# EAGLE design sw4 (EAGLE 6.6.0)
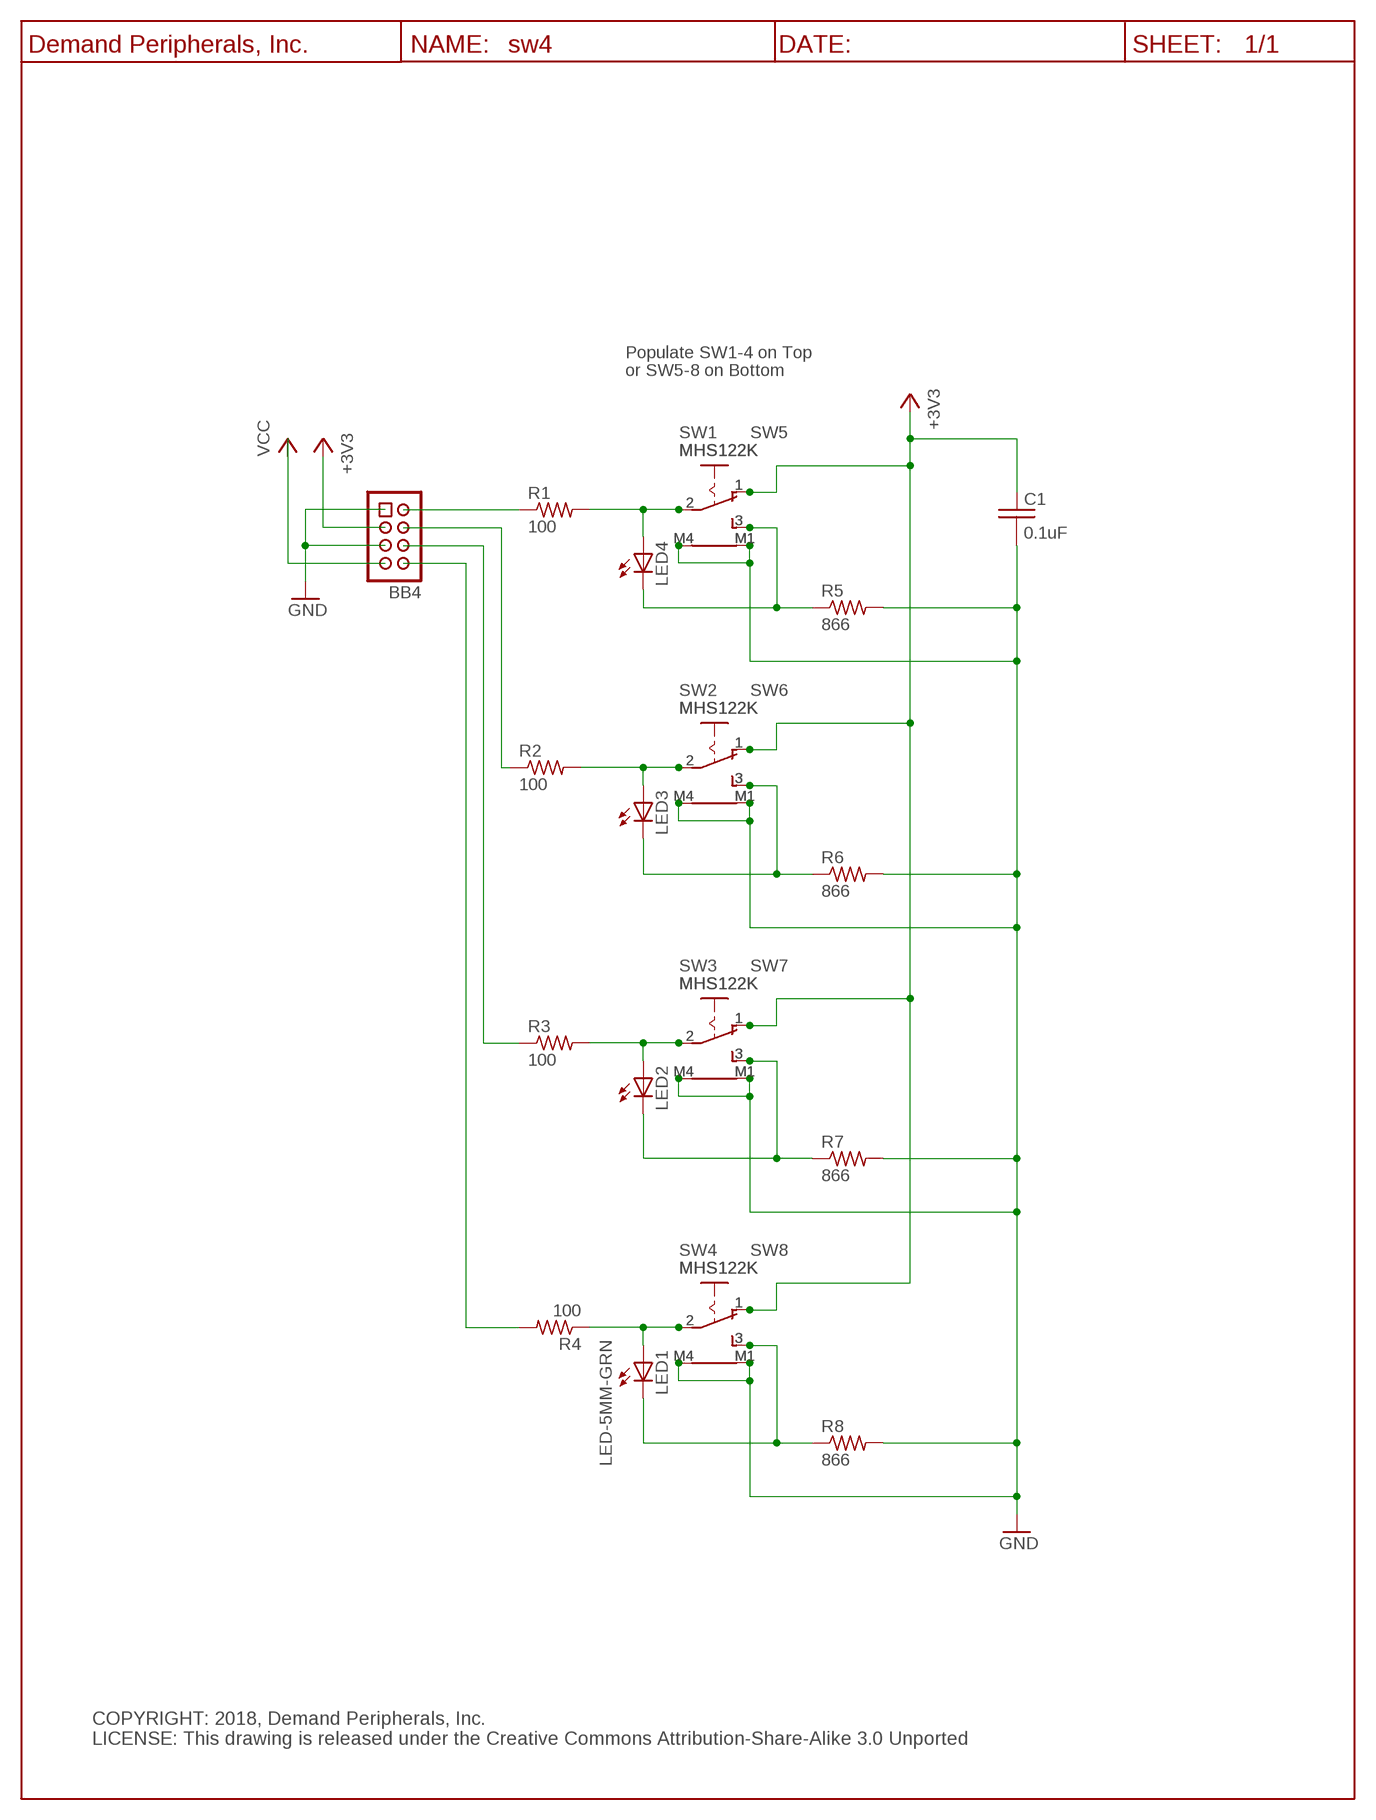
[diagram p0: schematic, sheet 1]

## Parts
BB4  hdr4x2  HDR-4X2-SHR  [HDR-4X2]
C1  0.1uF  C0.1UF_C0603  [C0603]
LED1  LED-5MM-GRN  [LED5MM]
LED2  LED-5MM-GRN  [LED5MM]
LED3  LED-5MM-GRN  [LED5MM]
LED4  LED-5MM-GRN  [LED5MM]
R1  100  R100_R0603  [R0603]
R2  100  R100_R0603  [R0603]
R3  100  R100_R0603  [R0603]
R4  100  R100_R0603  [R0603]
R5  866  R866_R0603  [R0603]
R6  866  R866_R0603  [R0603]
R7  866  R866_R0603  [R0603]
R8  866  R866_R0603  [R0603]
SW1  MHS122K  [MHS122K]
SW2  MHS122K  [MHS122K]
SW3  MHS122K  [MHS122K]
SW4  MHS122K  [MHS122K]
SW5  MHS122K  [MHS122K]
SW6  MHS122K  [MHS122K]
SW7  MHS122K  [MHS122K]
SW8  MHS122K  [MHS122K]
U$1  DP_FRAME_P  [P_FRAME]

## Nets
+3V3: BB4.3 C1.1 SW1.1(O) SW2.1(O) SW3.1(O) SW4.1(O) SW5.1(O) SW6.1(O) SW7.1(O) SW8.1(O)
GND: BB4.1 BB4.5 C1.2 R5.2 R6.2 R7.2 R8.2 SW1.M1(B1) SW1.M4(B) SW2.M1(B1) SW2.M4(B) SW3.M1(B1) SW3.M4(B) SW4.M1(B1) SW4.M4(B) SW5.M1(B1) SW5.M4(B) SW6.M1(B1) SW6.M4(B) SW7.M1(B1) SW7.M4(B) SW8.M1(B1) SW8.M4(B)
N$1: BB4.8 R4.2
N$3: LED4.C R5.1 SW1.3(S) SW5.3(S)
N$7: LED4.A R1.2 SW1.2(P) SW5.2(P)
N$9: LED3.A R2.2 SW2.2(P) SW6.2(P)
N$11: LED2.A R3.2 SW3.2(P) SW7.2(P)
N$13: LED1.A R4.1 SW4.2(P) SW8.2(P)
N$16: LED3.C R6.1 SW2.3(S) SW6.3(S)
N$17: LED2.C R7.1 SW3.3(S) SW7.3(S)
N$18: LED1.C R8.1 SW4.3(S) SW8.3(S)
N$30: BB4.2 R1.1
N$38: BB4.6 R3.1
N$41: BB4.4 R2.1
VCC: BB4.7

## Notes on the sheet
- Populate SW1-4 on Top
- or SW5-8 on Bottom
- COPYRIGHT: 2018, Demand Peripherals, Inc.
  LICENSE: This drawing is released under the Creative Commons Attribution-Share-Alike 3.0 Unported

## Library data of the parts
BB4 = dpi-conn:HDR-4X2-SHR: Shrouded 4x2 pin header; VENDOR: Digikey; VENDOR-PART-NUM: 609-3530-ND
C1 = dpi-passive:C0.1UF_: 0.1 uF Capacitor, 25V, X7R; VENDOR: Digikey; VENDOR-PART-NUM: 1276-1126-2-ND
LED1-LED4 = dpi-diopto:LED-5MM-GRN: Green LED, 5 MM, through-hole; VENDOR: Digikey; VENDOR-PART-NUM: 160-1852-ND
R1-R4 = dpi-passive:R100_: 100 Ohm resistor, 1%, 0.1 watt; VENDOR: Digikey; VENDOR-PART-NUM: 311-100HRTR-ND
R5-R8 = dpi-passive:R866_: 866 Ohm resistor, 1%, 0.1 watt; VENDOR: Digikey; VENDOR-PART-NUM: 311-866HRTR-ND
SW1-SW8 = dpi-swsens:MHS122K: SPDT SLIDE SWITCH; VENDOR: Digikey; VENDOR-PART-NUM: 679-1866-ND
U$1 = dpi-sym:DP_FRAME_P: Portrait/Letter Document Frame

## Board
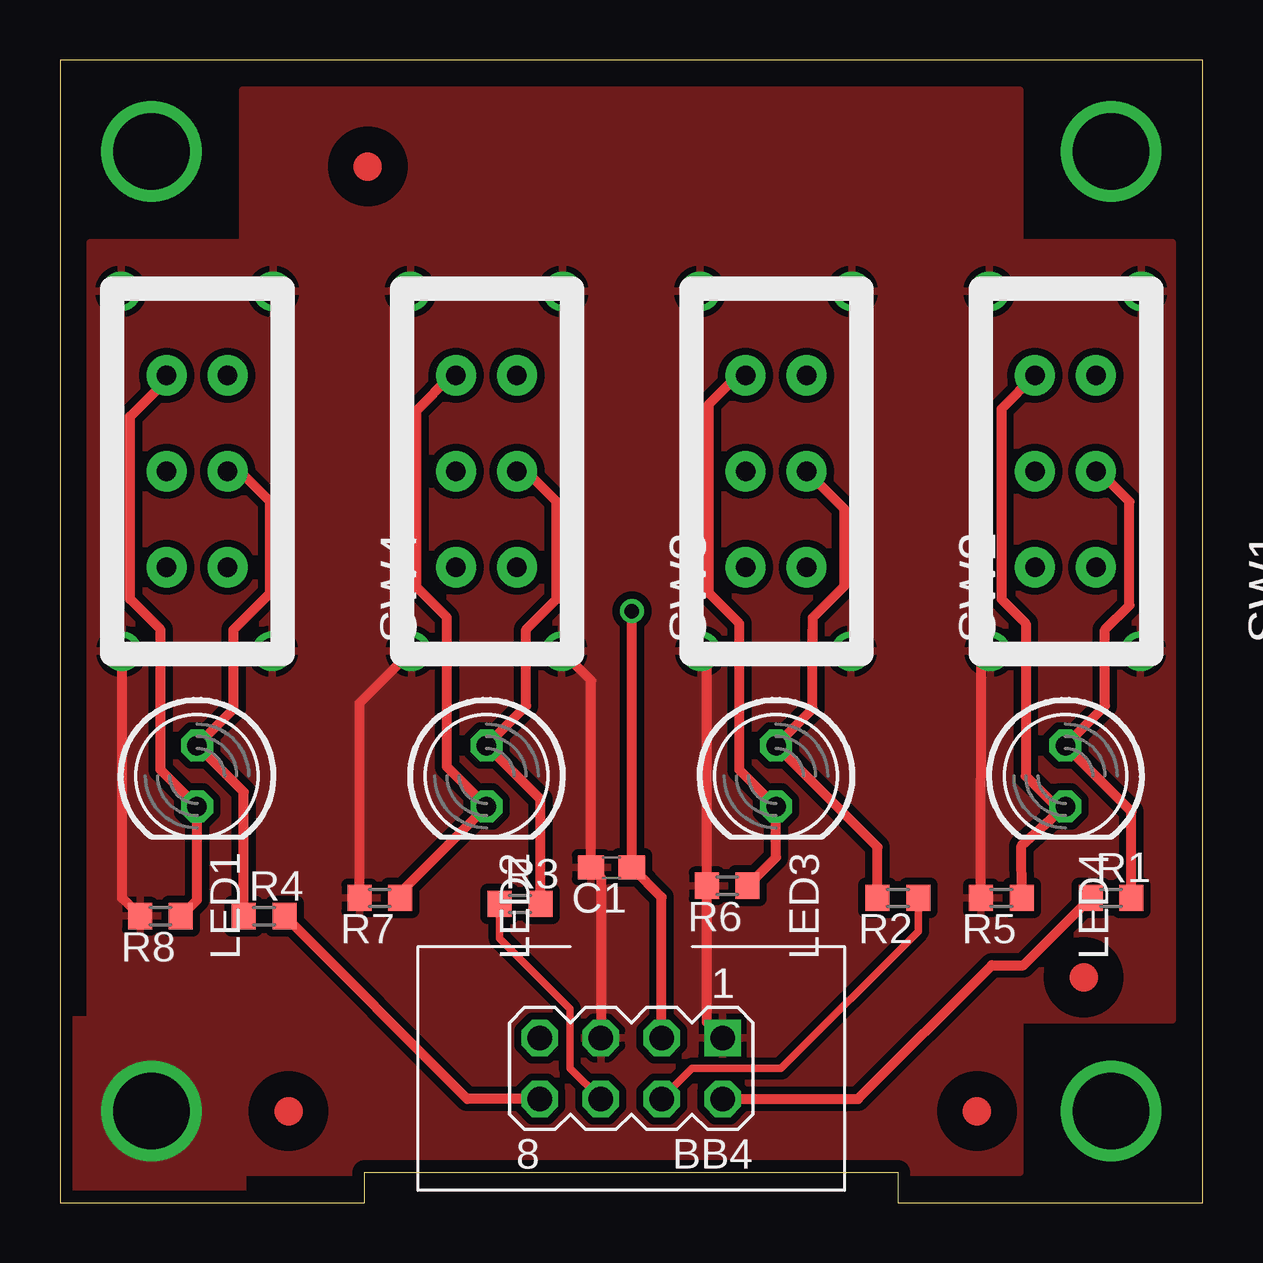
[diagram p1: board, top side]
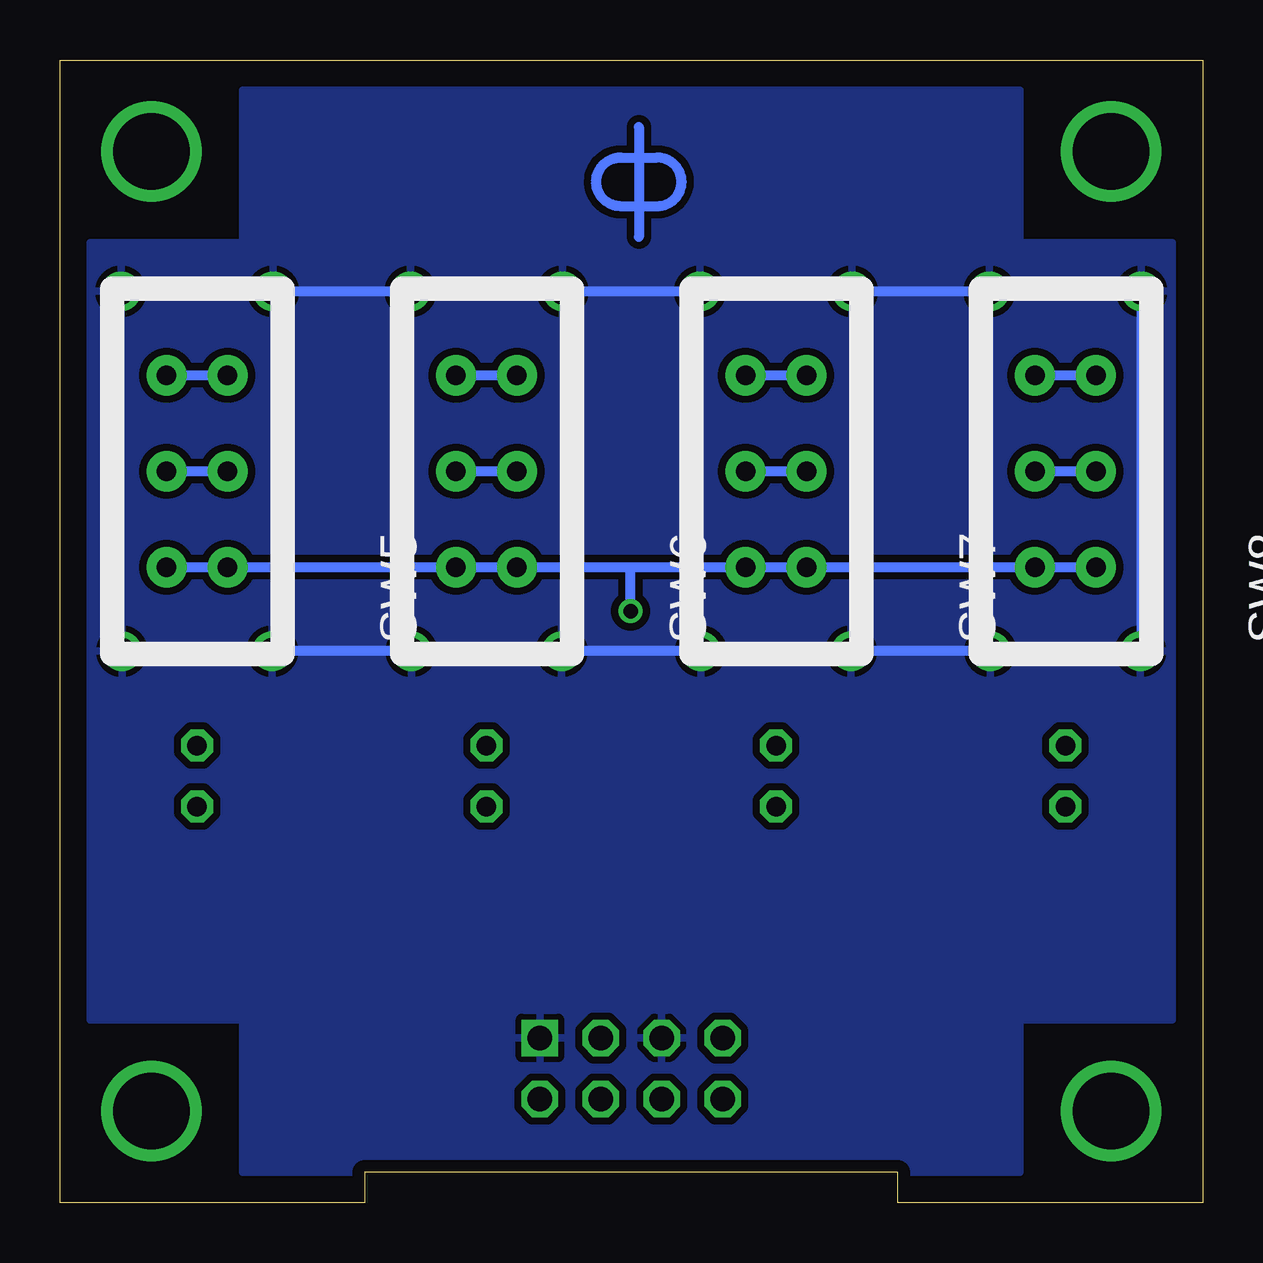
[diagram p2: board, bottom side, seen from below]

Size 47.62 x 47.62 mm. Coordinates in mm from the lower left corner, seen from the top.
Outline: 47.62,0 47.62,47.62 0,47.62 0,0 12.7,0 12.7,1.27 34.92,1.27 34.92,0 47.62,0
Copper layers (1*16): Top 0.035mm / dielectric 1.5mm / Bottom 0.035mm
Design rules "default *": minimum track width 10mil, minimum drill 20mil, track to track 12mil, track to pad 12mil, pad to pad 12mil, via to via 12mil, smd to smd 12mil, copper to edge 20mil, drill to drill 12mil, minimum pad ring 10mil, minimum via ring 8mil, stop-mask expansion 4mil, vias tented up to drill 0mil, thermal gap 10mil

### Footprints (pad centres in the part's own frame; a part is rotated, then mirrored left to right if it is on the bottom)
HDR-4X2 = drill 1.016 square: 1 -3.81,-1.27 | drill 1.016 octagon: 2 -3.81,1.27; 3 -1.27,-1.27; 4 -1.27,1.27; 5 1.27,-1.27; 6 1.27,1.27; 7 3.81,-1.27; 8 3.81,1.27
C0603 = smd 1.1 x 1: 1 -0.85,0; 2 0.85,0
LED5MM = drill 0.813 octagon: A -1.27,0; C 1.27,0
R0603 = smd 1 x 1.1: 1 -0.85,0; 2 0.85,0
MHS122K = drill 0.813 pad 1.676: 1 4,0; 2 0,0; 3 -4,0 | drill 1.1: M1 -7.5,1.9; M4 7.5,-4.4

### Placement (x,y rotation side)
BB4  23.81,5.59 180 top
C1  22.99,13.97 180 top
LED1  5.71,17.78 270 top
LED2  17.78,17.78 270 top
LED3  29.84,17.78 270 top
LED4  41.91,17.78 270 top
R1  43.81,12.7 0 top
R2  34.92,12.7 180 top
R3  19.18,12.45 0 top
R4  8.51,11.94 0 top
R5  39.24,12.7 180 top
R6  27.81,13.21 180 top
R7  13.34,12.7 180 top
R8  4.19,11.94 180 top
SW1  43.18,30.48 270 top
SW2  31.11,30.48 270 top
SW3  19.05,30.48 270 top
SW4  6.99,30.48 270 top
SW5  40.64,30.48 270 bottom
SW6  28.57,30.48 270 bottom
SW7  16.51,30.48 270 bottom
SW8  4.45,30.48 270 bottom
U$1  -2.54,-2.54 90 top
U$3  [FIDUCIAL]  12.83,43.18 0 top
U$4  [FIDUCIAL]  38.23,3.81 0 top
U$5  [FIDUCIAL]  42.67,9.39 90 top
U$6  [FIDUCIAL]  9.53,3.81 90 top
U$7  [DPI-1]  23.5,42.55 0 bottom

### Tracks (layer width: path | path; a pad name or v marks a point on that pad's centre or on a via)
+3V3  (via drill 0.6)
  Top 0.406: v23.84,24.65 C1.1 25.08,12.72 BB4.3
  Bottom 0.406: SW1.1 SW5.1 SW2.1 SW6.1 23.93,26.48 | SW8.1 SW4.1 SW7.1 SW3.1 23.93,26.48 | v23.84,24.65 23.84,26.39 23.93,26.48
GND  (via drill 3.17 pad 3.17)
  Top 0.406: R5.2 38.41,22.67 SW1.M4 | SW7.M4 22.14,21.75 C1.2 22.54,13.56 BB4.5 | BB4.1 26.96,7.52 R6.2 26.96,22.73 SW2.M4 | R8.2 2.58,12.69 SW4.M4 | R7.2 12.48,20.82 SW3.M4
  Bottom 0.406: SW1.M1 SW5.M1 SW2.M1 SW6.M1 SW3.M1 SW7.M1 SW4.M1 SW8.M1 2.54,22.98 SW4.M4 SW8.M4 SW3.M4 SW7.M4 SW2.M4 SW6.M4 | 32.98,23.05 SW6.M4 | SW6.M4 SW1.M4 SW5.M4
  other vias: 3.81,3.81
  pour Top (isolate 0.254): 40.01,1.27 7.62,1.27 7.62,0.51 0.51,0.51 0.51,7.62 1.27,7.62 1.27,40.01 7.62,40.01 7.62,46.35 40.01,46.35 40.01,40.01 46.35,40.01 46.35,7.62 40.01,7.62
  pour Bottom (isolate 0.254): 40.01,1.27 7.62,1.27 7.62,7.62 1.27,7.62 1.27,40.01 7.62,40.01 7.62,46.35 40.01,46.35 40.01,40.01 46.35,40.01 46.35,7.62 40.01,7.62
MOUNT  (via drill 3.17 pad 3.17)
  other vias: 3.81,43.81
N$1
  Top 0.406: BB4.8 16.98,4.32 R4.2
N$3
  Top 0.406: SW5.3 39.24,33.08 39.24,25.15 40.26,24.13 40.26,17.78 41.53,16.51 LED4.C 40.08,14.87 R5.1
  Bottom 0.406: SW1.3 SW5.3
N$4  (via drill 3.17 pad 3.17)
  other vias: 43.81,3.81
N$7
  Top 0.406: SW1.2 43.31,30.48 44.58,29.21 44.58,24.89 43.56,23.88 43.56,20.7 LED4.A 44.66,16.3 R1.2
  Bottom 0.406: SW1.2 SW5.2
N$9
  Top 0.406: 31.37,23.36 31.37,20.57 LED3.A 34.08,14.82 R2.2 | 31.37,23.36 31.37,23.88 | SW2.2 32.68,28.92 32.68,25.68 31.37,24.37 31.37,23.36
  Bottom 0.406: SW2.2 SW6.2
N$11
  Top 0.406: R3.2 20.03,16.8 LED2.A 19.43,20.7 19.43,23.88 20.7,25.15 20.7,29.21 19.43,30.48 SW3.2
  Bottom 0.406: SW3.2 SW7.2
N$13
  Top 0.406: SW4.2 7.49,30.48 8.76,29.21 8.76,25.4 7.24,23.88 7.24,20.57 LED1.A 7.66,17.11 R4.1
  Bottom 0.406: SW4.2 SW8.2
N$15  (via drill 3.17 pad 3.17)
  other vias: 43.81,43.81
N$16
  Top 0.406: SW6.3 28.26,34.48 27.05,33.27 27.05,25.4 28.32,24.13 28.32,18.03 LED3.C 29.84,14.39 R6.1
  Bottom 0.406: SW2.3 SW6.3
N$17
  Top 0.406: SW7.3 16.32,34.48 14.86,33.02 14.86,25.65 16.13,24.38 16.13,18.16 LED2.C 14.19,12.91 R7.1
  Bottom 0.406: SW3.3 SW7.3
N$18
  Top 0.406: SW8.3 4.45,34.29 2.92,32.77 2.92,25.15 4.19,23.88 4.19,18.03 LED1.C 5.71,12.61 R8.1
  Bottom 0.406: SW4.3 SW8.3
N$30
  Top 0.406: BB4.2 33.26,4.32 38.84,9.89 40.16,9.89 R1.1
N$38
  Top 0.305: BB4.6 21.26,5.6 21.26,7.15 21.26,8.08 18.41,10.92 18.33,11.01 R3.1
N$41
  Top 0.305: BB4.4 26.35,5.59 28.84,5.59 30.06,5.59 35.78,11.3 R2.1

### Text on the board
tTest: 1.875 Inches | 1.575 Inches | SW4, Rev 17A | 1 | 2 | 3 | 4 | 1 | 2 | 3 | 4 | 1.575 Inches | 1.875 Inches | R3 | C1 | R7 | R6 | R2 | R5 | R1 | R8 | R4 | (C) 2017, Demand Peripherals, Inc. | BB4
bTest: 1 | 2 | 3 | 4 | 1 | 2 | 3 | 4